# EasyEDA Pro project boost.epro

# Schematic Schematic1
Board Name: Board1; Create Date: 2024-12-09; Page Name: P1; Project Name: 电力电子课设; Schematic Name: Schematic1; Update Date: 2024-12-30; Company: 202121724407; Drawed: 丁泽侨; Page Size: A4; Version: V1.0
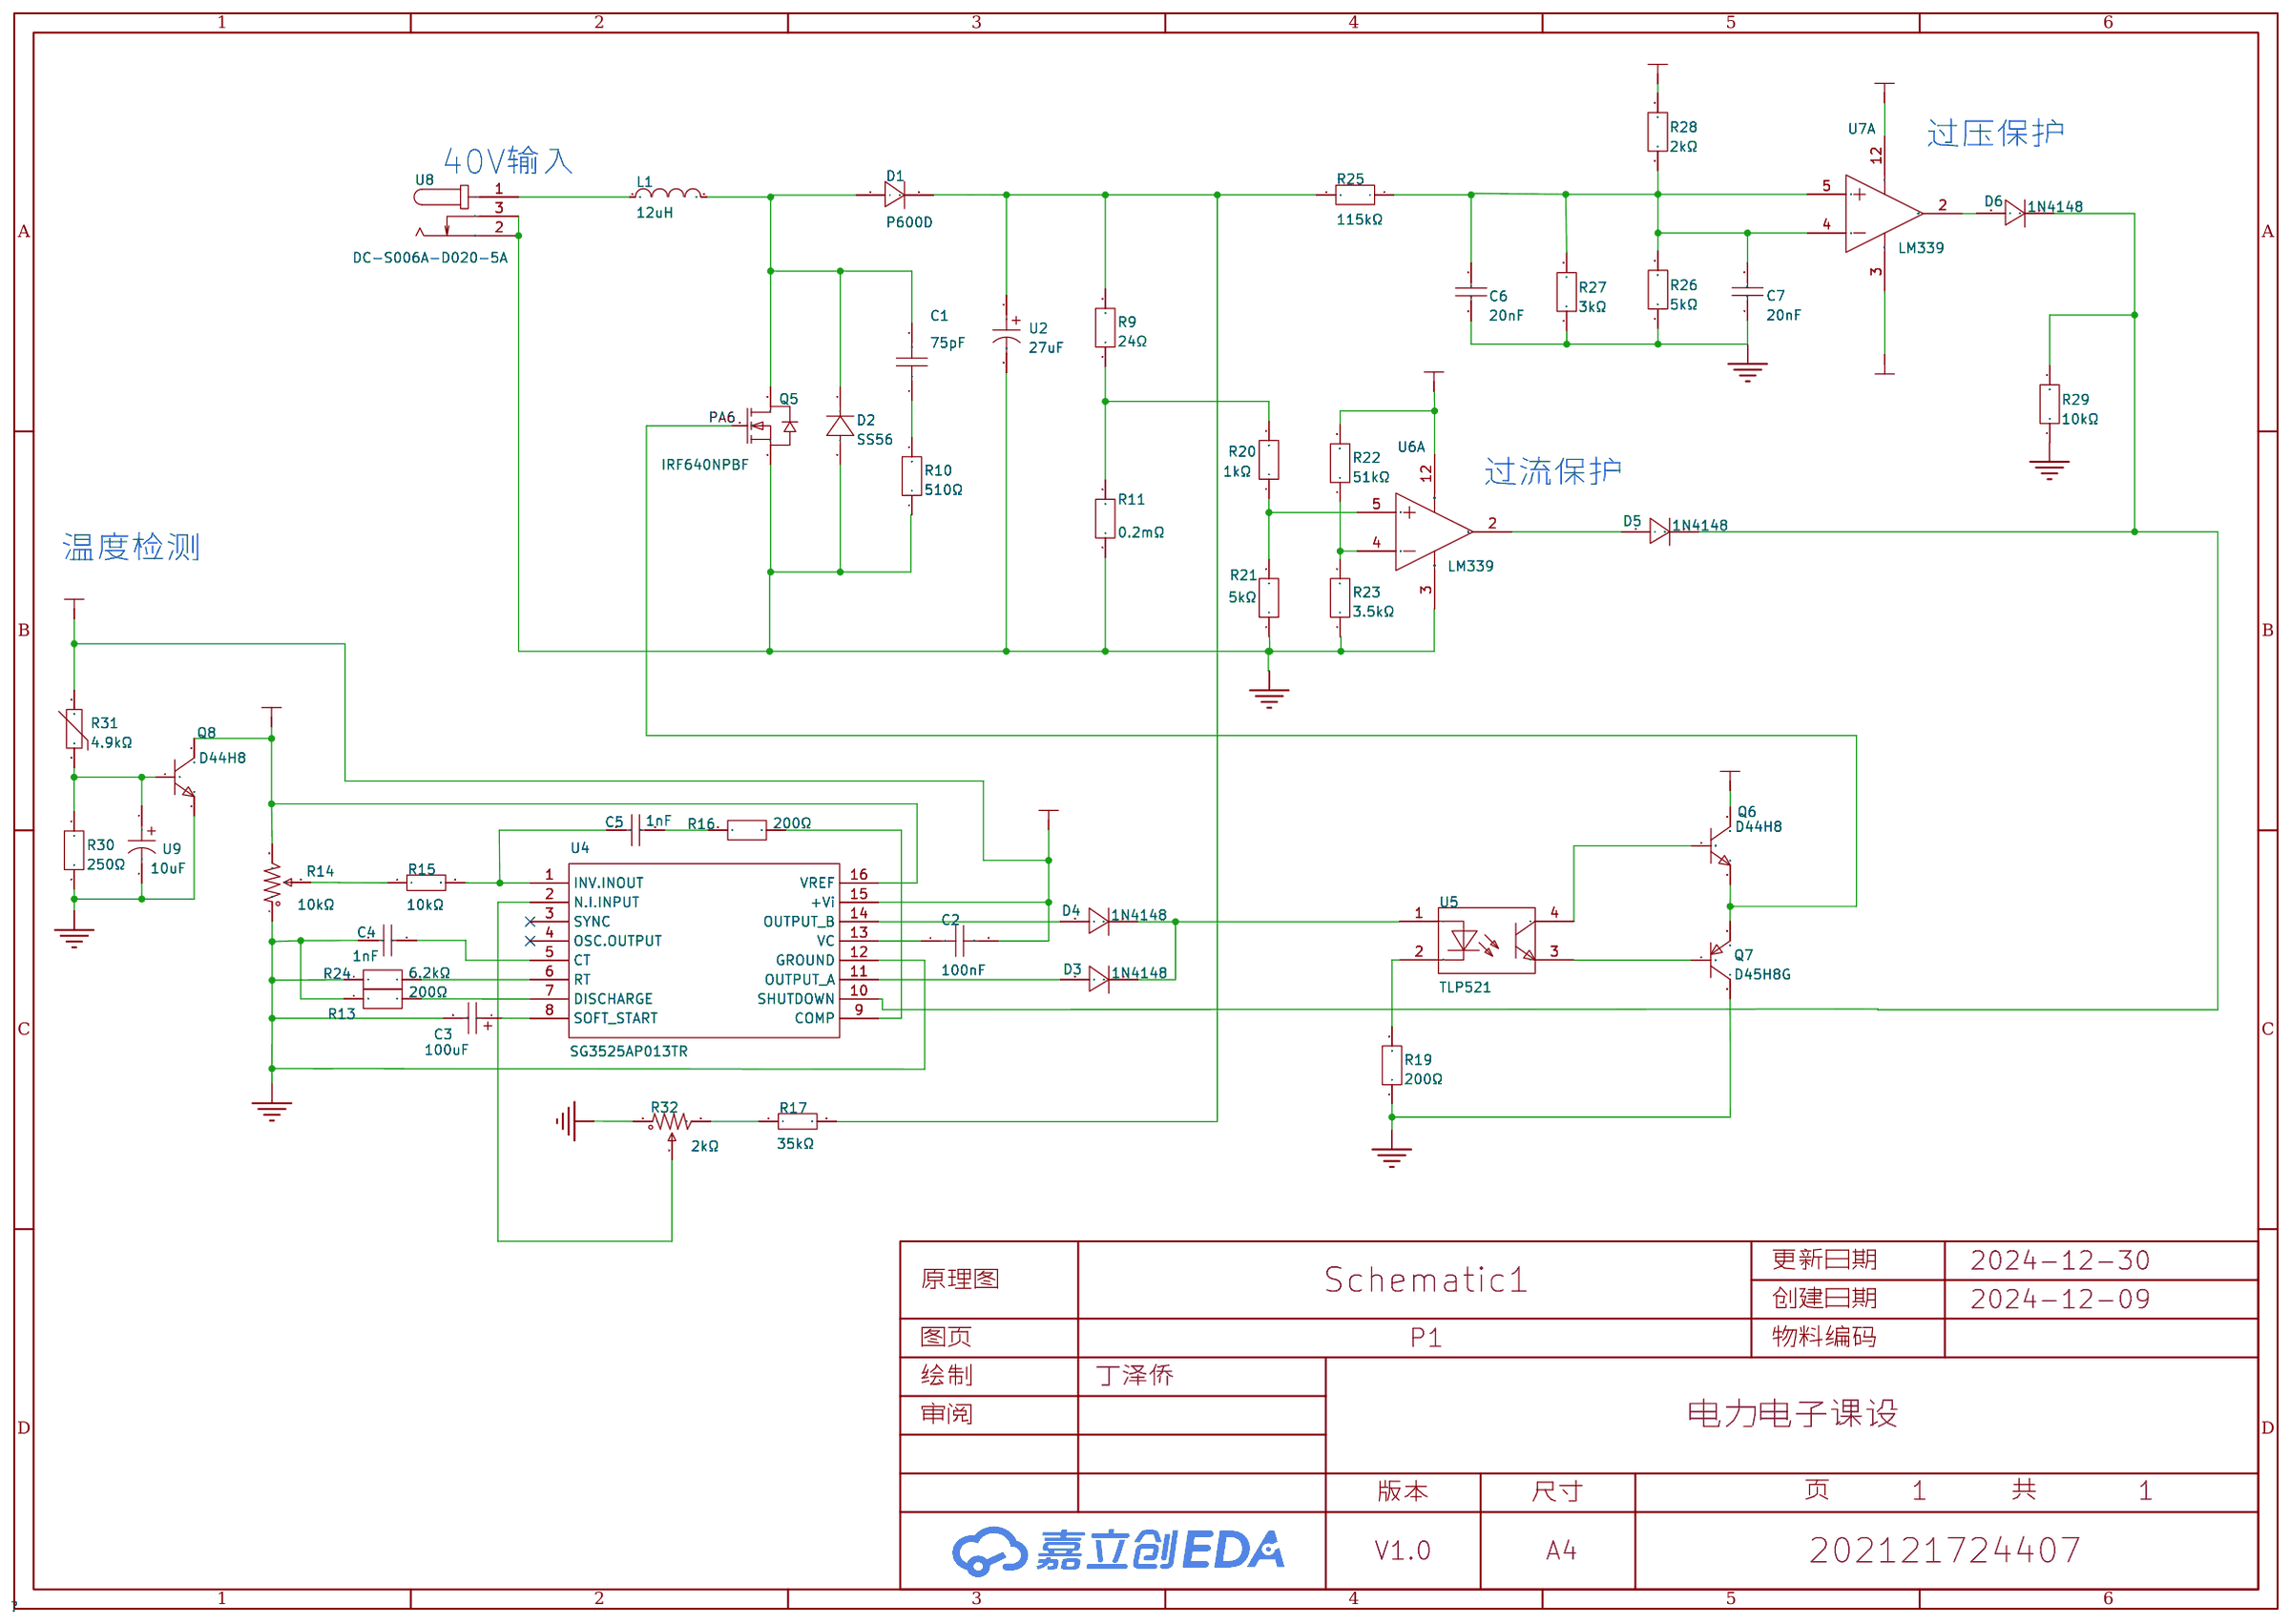
[diagram p0: schematic sheet]

## Parts
C1  75pF  [C0603]
C2  100nF  [C0603]
C3  100uF  [CASE-D_7343]
C4  1nF  [C0603]
C5  1nF  [C0603]
C6  20nF  [C0603]
C7  20nF  [C0603]
D1  P600D  [R-6_BD9.0-L9.0-P13.00-D1.6-RD]
D2  SS56  [SMA_L4.3-W2.7-LS5.1-RD]
D3  1N4148  [DO-35_BD2.0-L4.2-P8.20-D0.5-RD]
D4  1N4148  [DO-35_BD2.0-L4.2-P8.20-D0.5-RD]
D5  1N4148  [DO-35_BD2.0-L4.2-P8.20-D0.5-RD]
D6  1N4148  [DO-35_BD2.0-L4.2-P8.20-D0.5-RD]
L1  12uH  [L1206]
Q5  IRF640NPBF  [TO-220-3_L10.0-W4.5-P2.54-L]
Q6  D44H8  [TO-220-3_L10.0-W4.5-P2.54-L]
Q7  D45H8G  [TO-220-3_L10.0-W4.5-P2.54-T]
Q8  D44H8  [TO-220-3_L10.0-W4.5-P2.54-L]
R9  24Ω  [R1206]
R10  510Ω  [R0603]
R11  0.2mΩ  [R3920]
R13  200Ω  [R0603]
R14  10kΩ  [RES-ADJ-SMD_3P-L3.0-W3.8-P1.75-BR]
R15  10kΩ  [R0805]
R16  200Ω  [R0603]
R17  35kΩ  [R0805]
R19  200Ω  [R0603]
R20  1kΩ  [R0603]
R21  5kΩ  [R0603]
R22  51kΩ  [R0603]
R23  3.5kΩ  [R0603]
R24  6.2kΩ  [R0603]
R25  115kΩ  [R0603]
R26  5kΩ  [R0603]
R27  3kΩ  [R0603]
R28  2kΩ  [R0603]
R29  10kΩ  [R0603]
R30  250Ω  [R0603]
R31  4.9kΩ  [RES-TH_L22.0-W7.0-P7.50-D1.0-S1.00]
R32  2kΩ  [RES-ADJ-SMD_3P-L3.0-W3.8-P1.75-BR]
U2  27uF  [CAP-TH_BD8.0-P3.50-D0.5-FD]
U4  SG3525AP013TR  [SOIC-16_L9.9-W3.9-P1.27-LS6.0-BL]
U5  TLP521  [SOP-4_L6.4-W4.6-P2.54-LS10.2-TL]
U6  LM339  [SOP-14_L8.7-W3.9-P1.27-LS6.0-BL]  (section 1)
U7  LM339  [SOP-14_L8.7-W3.9-P1.27-LS6.0-BL]  (section 1)
U8  DC-S006A-D020-5A  [CONN-TH_DC-S006A-D020-5A]
U9  10uF  [CAP-TH_BD8.0-P3.50-D0.5-FD]

## Library data of the parts
C1 = CC0603JRNPO9BN750: 容值:75pF;精度:±5%;额定电压:50V;材质(温度系数):NP0;; LCSC Part Name: 75pF ±5% 50V; Supplier Part: C282074; Manufacturer: YAGEO(国巨); Supplier Footprint: 0603; Datasheet: https://atta.szlcsc.com/upload/public/pdf/source/20181008/C309499_21CC21451B82C39E3D92150FD6B30293.pdf; Supplier: LCSC; Tolerance: ±5%; Voltage Rated: 50V; Temperature Coefficient: NP0
C2 = CGA0603X7R104K500JT: 容值:100nF;精度:±10%;额定电压:50V;材质(温度系数):X7R;; LCSC Part Name: 100nF ±10% 50V; Supplier Part: C6119867; Manufacturer: HRE(芯声); Supplier Footprint: 0603; Supplier: LCSC; Tolerance: ±10%; Voltage Rated: 50V; Temperature Coefficient: X7R
C3 = 16TQC100MYF: 容值:100uF;精度:±20%;额定电压:16V;等效串联电阻:50mΩ@100kHz;; LCSC Part Name: 100uF ±20% 16V; Supplier Part: C109085; Manufacturer: PANASONIC(松下); Datasheet: https://atta.szlcsc.com/upload/public/pdf/source/20180327/C178360_45C3E0E4231676737BD215E9C4CFE59C.pdf; Supplier: LCSC; Tolerance: ±20%; Rated Voltage: 16V; Equivalent Series Resistance(ESR): 50mΩ@100kHz; Operating Temperature: -55℃~+105℃
C4-C7 = CC0603KRX7R9BB102: 容值:1nF;精度:±10%;额定电压:50V;材质(温度系数):X7R;; LCSC Part Name: 1nF ±10% 50V; Supplier Part: C100040; Manufacturer: YAGEO(国巨); Supplier Footprint: 0603; Datasheet: https://atta.szlcsc.com/upload/public/pdf/source/20180910/C282072_33301C7F631E79921B82A8DAC6BCC5B3.pdf; Supplier: LCSC; Tolerance: ±10%; Voltage Rated: 50V; Temperature Coefficient: X7R
D1 = P600D: 二极管配置:-;正向压降(Vf):1V@6A;直流反向耐压(Vr):200V;平均整流电流(Io):6A;; LCSC Part Name: 电压:200V 电流:6A; Supplier Part: C424505; Manufacturer: SUNMATE(森美特); Supplier Footprint: R-6; Datasheet: https://atta.szlcsc.com/upload/public/pdf/source/20190903/C424505_2D2B09BDA3BA7CD9DE5E983884216293.pdf; Supplier: LCSC; Forward Voltage (Vf@If): 1V@6A; Reverse Voltage (Vr): 200V; Average Rectified Current (Io): 6A; Reverse Leakage Current: 5uA@200V
D2 = SS56_C5140024: 二极管配置:独立式;正向压降(Vf):700mV@5A;直流反向耐压(Vr):60V;整流电流:5A;; LCSC Part Name: 电压:60V 电流:5A; Supplier Part: C5140024; Manufacturer: MSKSEMI(美森科); Supplier Footprint: SMA; JLCPCB Part Class: 扩展库; Datasheet: https://atta.szlcsc.com/upload/public/pdf/source/20220822/38BF26C19E76BD3A08D8A2847C16210D.pdf; Supplier: LCSC; Diode Configuration: 独立式; Forward Voltage (Vf@If): 700mV@5A; Reverse Voltage (Vr): 60V; Rectified Current: 5A; Reverse Leakage Current: 100uA@60V
D3-D6 = 1N4148_C402212: 二极管配置:-;正向压降(Vf):1V@10mA;直流反向耐压(Vr):75V;平均整流电流(Io):150mA;功率:500mW;反向恢复时间(trr):4ns;; LCSC Part Name: 电压:75V 电流:150mA; Supplier Part: C402212; Manufacturer: LGE(鲁光); Supplier Footprint: DO-35; Datasheet: https://atta.szlcsc.com/upload/public/pdf/source/20190705/C402212_D6CD0A8EA8714742E0940C7C02C37BFA.pdf; Supplier: LCSC; Forward Voltage (Vf@If): 1V@10mA; Reverse Voltage (Vr): 75V; Average Rectified Current (Io): 150mA; Power Dissipation: 500mW; Reverse Leakage Current: 5uA@75V; Reverse Recovery Time (trr): 4ns
L1 = CMP321609XD120MT: 电感值:12uH;精度:±20%;额定电流:300mA;饱和电流(Isat):-;直流电阻(DCR):550mΩ;; LCSC Part Name: 12uH ±20%; Supplier Part: C395030; Manufacturer: FH(风华); Supplier Footprint: 1206; JLCPCB Part Class: 扩展库; Datasheet: https://atta.szlcsc.com/upload/public/pdf/source/20230223/9514AABD49028510480EFFDFC3336E06.pdf; Supplier: LCSC; Tolerance: ±20%; Rated Current: 300mA; DC Resistance (DCR): 550mΩ; Frequency - Self Resonant: 22MHz
Q5 = IRF640NPBF: 类型:1个N沟道;漏源电压(Vdss):200V;连续漏极电流(Id):18A;导通电阻(RDS(on)@Vgs,Id):150mΩ@10V,11A;功率(Pd):150W;阈值电压(Vgs(th)@Id):2V@250uA;; LCSC Part Name: 1个N沟道 耐压:200V 电流:18A; Supplier Part: C2568; Manufacturer: Infineon(英飞凌); Supplier Footprint: TO-220AB; Datasheet: https://atta.szlcsc.com/upload/public/pdf/source/20200421/C513193_23749609D07D92AF73E2CC33035BD226.pdf; Supplier: LCSC; Type: 1个N沟道; Drain Source Voltage (Vdss): 200V; Continuous Drain Current (Id): 18A; Drain Source On Resistance (RDS(on)@Vgs,Id): 150mΩ@10V,11A; Power Dissipation (Pd): 150W; Gate Threshold Voltage (Vgs(th)@Id): 2V@250uA; Total Gate Charge (Qg@Vgs): 67nC@10V; Input Capacitance (Ciss@Vds): 1.16nF; Reverse Transfer Capacitance (Crss@Vds): 53pF; Operating Temperature: -55℃~+175℃
Q6 Q8 = D44H8: 晶体管类型:NPN;集电极电流(Ic):10A;集射极击穿电压(Vceo):60V;功率(Pd):50W;直流电流增益(hFE@Ic,Vce):40@4A,1V;; LCSC Part Name: NPN 电流:10A 耐压:60V; Supplier Part: C480204; Manufacturer: SPTECH(深圳质超); Supplier Footprint: TO-220C; JLCPCB Part Class: 扩展库; Datasheet: https://atta.szlcsc.com/upload/public/pdf/source/20241108/482BDF86B4525000AB03C3E2B207BB32.pdf; Supplier: LCSC; Transistor Type: NPN; Collector Current (Ic): 10A; Collector-Emitter Breakdown Voltage (Vceo): 60V; Power Dissipation (Pd): 50W; DC Current Gain (hFE@Ic,Vce): 40@4A,1V; Transition Frequency (fT): 50MHz; Collector-Emitter Saturation Voltage (VCE(sat)@Ic,Ib): 1V@8A,400mA
Q7 = D45H8G: 晶体管类型:PNP;集电极电流(Ic):10A;集射极击穿电压(Vceo):60V;功率(Pd):2W;直流电流增益(hFE@Ic,Vce):40@4A,1V;; LCSC Part Name: 耐压:60V 电流:10A PNP; Supplier Part: C146760; Manufacturer: onsemi(安森美); Supplier Footprint: TO-220; JLCPCB Part Class: 扩展库; Datasheet: https://atta.szlcsc.com/upload/public/pdf/source/20180125/C146760_15168615777141301698.pdf; Supplier: LCSC; Transistor Type: PNP; Collector Current (Ic): 10A; Collector-Emitter Breakdown Voltage (Vceo): 60V; Power Dissipation (Pd): 2W; DC Current Gain (hFE@Ic,Vce): 40@4A,1V; Transition Frequency (fT): 40MHz; Collector Cut-Off Current (Icbo): 10uA; Collector-Emitter Saturation Voltage (VCE(sat)@Ic,Ib): 1V@8A,400mA; Operating Temperature: -55℃~+150℃@(Tj)
R9 = FRC1206F24R0TS: 电阻类型:厚膜电阻;阻值:24Ω;精度:±1%;功率:250mW;最大工作电压:200V;温度系数:±100ppm/℃;; LCSC Part Name: 24Ω ±1% 250mW 厚膜电阻; Supplier Part: C2930421; Manufacturer: FOJAN(富捷); Supplier Footprint: 1206; JLCPCB Part Class: 扩展库; Datasheet: https://atta.szlcsc.com/upload/public/pdf/source/20211221/925EC7D7225764EE0046F22065062C87.pdf; Supplier: LCSC; Type: 厚膜电阻; Tolerance: ±1%; Power(Watts): 250mW; Overload Voltage (Max): 200V; Temperature Coefficient: ±100ppm/℃; Operating Temperature Range: -55℃~+155℃
R10 = FRC0603J511 TS: 电阻类型:厚膜电阻;阻值:510Ω;精度:±5%;功率:100mW;最大工作电压:75V;温度系数:±100ppm/℃;; LCSC Part Name: 510Ω ±5% 100mW 厚膜电阻; Supplier Part: C2907179; Manufacturer: FOJAN(富捷); Supplier Footprint: 0603; Datasheet: https://atta.szlcsc.com/upload/public/pdf/source/20211221/925EC7D7225764EE0046F22065062C87.pdf; Supplier: LCSC; Type: 厚膜电阻; Tolerance: ±5%; Power(Watts): 100mW; Overload Voltage (Max): 75V; Temperature Coefficient: ±100ppm/℃; Operating Temperature Range: -55℃~+155℃
R11 = HolRS3920-5W-0.2mR-1%: 阻值:0.2mΩ;精度:±1%;功率:5W;; LCSC Part Name: 0.2mΩ ±1% 5W; Supplier Part: C558625; Manufacturer: Milliohm(毫欧); Supplier Footprint: 3920; JLCPCB Part Class: 扩展库; Datasheet: https://atta.szlcsc.com/upload/public/pdf/source/20200522/C558625_7915B34B9186274EB7EA9862EBA9CEA8.pdf; Supplier: LCSC; Tolerance: ±1%; Power(Watts): 5W
R13 R16 R19-R30 = FRC0603J201 TS: 电阻类型:厚膜电阻;阻值:200Ω;精度:±5%;功率:100mW;最大工作电压:75V;温度系数:±100ppm/℃;; LCSC Part Name: 200Ω ±5% 100mW 厚膜电阻; Supplier Part: C2907123; Manufacturer: FOJAN(富捷); Supplier Footprint: 0603; Datasheet: https://atta.szlcsc.com/upload/public/pdf/source/20211221/925EC7D7225764EE0046F22065062C87.pdf; Supplier: LCSC; Type: 厚膜电阻; Tolerance: ±5%; Power(Watts): 100mW; Overload Voltage (Max): 75V; Temperature Coefficient: ±100ppm/℃; Operating Temperature Range: -55℃~+155℃
R14 R32 = TC33X-2-103E: 阻值:10kΩ;精度:±25%;功率:150mW;温度系数:±250ppm/℃;; LCSC Part Name: 10kΩ ±25%; Supplier Part: C719176; Manufacturer: BOURNS; Supplier Footprint: SMD-3P,3.8x3.6mm; JLCPCB Part Class: 扩展库; Datasheet: https://atta.szlcsc.com/upload/public/pdf/source/20200810/C720646_BB66A75E654D5E1D30127FF45BCD3C26.pdf; Supplier: LCSC; Tolerance: ±25%; Power(Watts): 150mW; Temperature Coefficient: ±250ppm/℃; Turns: 1
R15 = 0805W8J0103T5E: 电阻类型:厚膜电阻;阻值:10kΩ;精度:±5%;功率:125mW;最大工作电压:150V;温度系数:±100ppm/℃;; LCSC Part Name: 10kΩ ±5% 125mW 厚膜电阻; Supplier Part: C25612; Manufacturer: UNI-ROYAL(厚声); Supplier Footprint: 0805; Datasheet: https://atta.szlcsc.com/upload/public/pdf/source/20200306/C422600_1E6D84923E4A46A82E41ADD87F860B5C.pdf; Supplier: LCSC; Type: 厚膜电阻; Tolerance: ±5%; Power(Watts): 125mW; Overload Voltage (Max): 150V; Temperature Coefficient: ±100ppm/℃; Operating Temperature Range: -55℃~+155℃
R17 = AR05BTCW3502: 电阻类型:薄膜电阻;阻值:35kΩ;精度:±0.1%;功率:125mW;最大工作电压:100V;温度系数:±25ppm/℃;; LCSC Part Name: 薄膜电阻 35kΩ ±0.1% 125mW; Supplier Part: C316215; Manufacturer: Viking(光颉); Supplier Footprint: 0805; JLCPCB Part Class: 扩展库; Datasheet: https://atta.szlcsc.com/upload/public/pdf/source/20181023/C316215_D2E2C4CF06F58C5C06BF015555FD2DBC.pdf; Supplier: LCSC; Type: 薄膜电阻; Tolerance: ±0.1%; Power(Watts): 125mW; Overload Voltage (Max): 100V; Temperature Coefficient: ±25ppm/℃; Operating Temperature Range: -55℃~+155℃
R31 = NTC 10D-20: 阻值(25℃):10Ω;B值(25℃/50℃):-;电阻精度:-;功率:-;B值精度:-;最大稳态电流(25℃):6A;; LCSC Part Name: 10Ω; Supplier Part: C42975; Manufacturer: RUILON(瑞隆源); Supplier Footprint: 插件,P=10mm; Datasheet: https://atta.szlcsc.com/upload/public/pdf/source/20180410/C207392_007A1CB20DB6E487C695D7783FF0F5F9.pdf; Supplier: LCSC; Resistance @ 25℃: 10Ω; Steady State Current (Max): 6A; Operating Temperature: -55℃~+200℃
U2 U9 = 87EC0488: 容值:27uF;精度:±20%;额定电压:400V;纹波电流:350mA@100kHz;等效串联电阻:600mΩ@100kHz;; LCSC Part Name: 27uF ±20% 400V; Supplier Part: C6718362; Manufacturer: KNSCHA(科尼盛); Supplier Footprint: 插件,D8xL18mm; JLCPCB Part Class: 扩展库; Datasheet: https://atta.szlcsc.com/upload/public/pdf/source/20230526/9C83C2B37A5BBEB97CE8FD3ED49C0F1C.pdf; Supplier: LCSC; Tolerance: ±20%; Rated Voltage: 400V; Ripple Current: 350mA@100kHz; Equivalent Series Resistance(ESR): 600mΩ@100kHz; Lead Spacing: 3.5mm; φD: 8mm; L: 18mm; Lifetime @ Temp: 2000hrs@105℃; Operating Temperature: -25℃~+105℃
U4 = SG3525AP013TR: 功能类型:-;输出类型:固定;工作电压:8V~35V;输出电压:-;输出电流:200mA;; LCSC Part Name: 脉宽调制控制器; Supplier Part: C68323; Manufacturer: ST(意法半导体); Supplier Footprint: SOIC-16; Datasheet: https://atta.szlcsc.com/upload/public/pdf/source/20160318/1458266987827.pdf; Supplier: LCSC; Output Type: 固定; Input Voltage: 8V~35V; Output Current: 200mA; Switching Frequency: 100Hz~500kHz; Operating Temperature: 0℃~+70℃; Synchronous Rectification: 否; Number of Outputs: 2; Topology: 推挽式; Quiescent Current (Iq): 14mA; Switch tube (built-in/external): 外置
U5 = TLP521: Supplier Part: C9900005355; Supplier Footprint: SOP-4-2.54mm; Supplier: LCSC
U6 U7 = LM339: LCSC Part Name: 低功耗偏移电压四路比较器; Supplier Part: C2829428; Manufacturer: CJ(江苏长电/长晶); Supplier Footprint: SOP-14; Datasheet: https://atta.szlcsc.com/upload/public/pdf/source/20220509/7630064B173EFBB548D5372525D9DF90.pdf; Supplier: LCSC; Supply Voltage: 2V~36V
U8 = DC-S006A-D020-5A: 连接器类型:DC电源插座;安装方式:弯插;触点内径:2mm;触点外径:6.4mm;额定电流:5A;额定电压:60V;工作温度范围:-40℃~+85℃;; LCSC Part Name: DC电源插座 内径:2mm 外径:6.4mm; Supplier Part: C7464907; Manufacturer: G-Switch(品赞); Supplier Footprint: 插件; Datasheet: https://atta.szlcsc.com/upload/public/pdf/source/20230721/E116832EB8D68796F814FCAA7291B68D.pdf; Supplier: LCSC; Connector Type: DC电源插座; Mounting Style: 弯插; Inside Contact Diameter: 2mm; Outside Contact Diameter: 6.4mm; Current Rating (Max): 5A; Voltage Rating (Max): 60V; Operating Temperature Range: -40℃~+85℃

## Nets
5.1V: Q8.2(C) R14.3 R28.2 U4.16(VREF)
15V: C2.2 Q6.2(C) R22.2 R31.2 U4.15(+Vi) U6.12(GND) U7.12(GND)
-15V: U7.3(VCC)
GND: C4.1 C6.1 C7.1 D2.2(A) Q5.3(S) Q7.2(C) Q8.3(E) R10.1 R11.1 R13.1 R14.1 R19.1 R23.1 R24.1 R26.1 R27.1 R29.1 R32.1 U4.12(GROUND) U8.2 U8.3 U9.2
PA6: Q5.1(G) Q6.3(E) Q7.3(E)
Net-(C1-1): C1.1 R10.2
Net-(C1-2): C1.2 D1.2(A) D2.1(K) L1.2 Q5.2(D)
Net-(C2-1): C2.1 U4.13(VC)
Net-(C3-1): C3.1 U4.8(SOFT_START)
Net-(C4-2): C4.2 U4.5(CT)
Net-(C5-1): C5.1 R15.2
Net-(C6-2): C6.2 C7.2 R25.1 R26.2 R27.2 U7.4(IN1-)
Net-(D3-1): D3.1(C) D4.1(C)
Net-(D4-2): D4.2(A) U4.14(OUTPUT B)
Net-(D5-1): D5.1(C) D6.1(C) R29.2 U4.10(SHUTDOWN)
Net-(Q6-1): Q6.1(B) U5.4
Net-(Q8-1): Q8.1(B) R30.1 R31.1 U9.1
Net-(R9-1): R9.1 R11.2 R20.2
Net-(R9-2): R9.2 R25.2 U2.1
Net-(R13-2): R13.2 U4.7(DISCHARGE)
Net-(R14-2): R14.2 R15.1
Net-(R16-2): R16.2 U4.9(COMP)
Net-(R17-1): R17.1 R32.3
Net-(R19-2): R19.2 U5.2
Net-(R21-2): R21.2 U6.5(IN1+)
Net-(R22-1): R22.1 R23.2 U6.4(IN1-)
Net-(R32-2): R32.2 U4.2(N.I.INPUT)

Not connected (* = marked no-connect by the designer): C3 2; C5 2; D1 1(C); D3 2(A); D5 2(A); D6 2(A); L1 1; Q7 1(B); R16 1; R17 2; R20 1; R21 1; R24 2; R28 1; R30 2; U2 2; U4 1(INV.INOUT) 3(SYNC)* 4(OSC.OUTPUT)* 6(RT) 11(OUTPUT A); U5 1 3; U6 2(OUT1) 3(VCC); U7 2(OUT1) 5(IN1+); U8 1

## Notes on the sheet
- 过压保护
- 40V输入
- 过流保护
- 温度检测
